# EAGLE schematic EspHeatController_v1.0 (EAGLE 9.7.0)

## Sheet 1 of 2
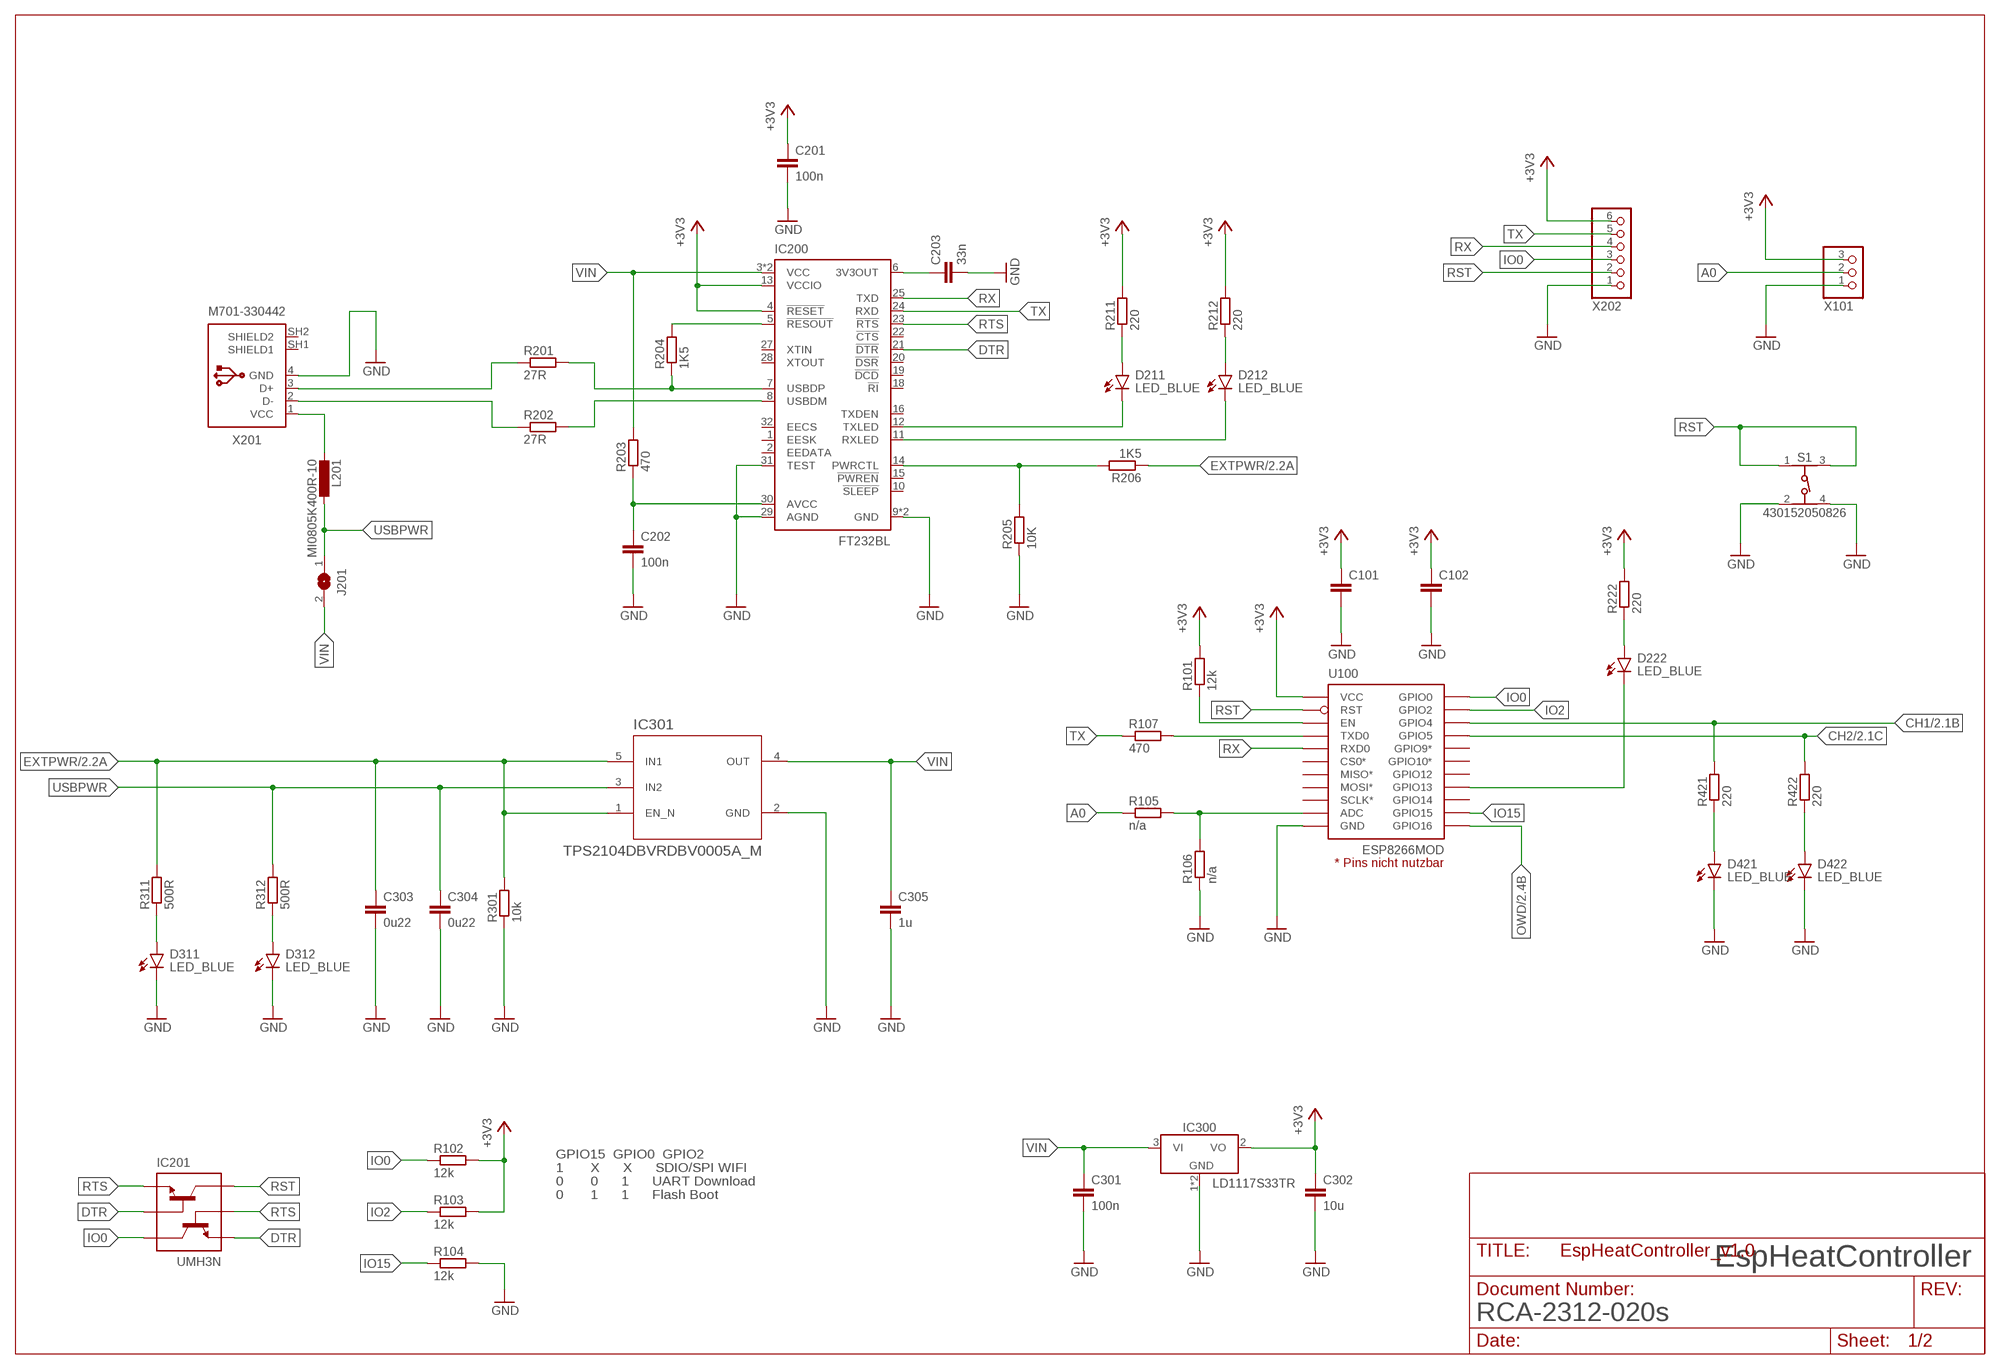
[diagram p0: schematic, sheet 1]

### Parts
C101  C-EUC0805  [C0805]
C102  C-EUC0805  [C0805]
C201  100n  C-EUC0805  [C0805]
C202  100n  C-EUC0805  [C0805]
C203  33n  C-EUC0805  [C0805]
C301  100n  C-EUC0805  [C0805]
C302  10u  C-EUC0805  [C0805]
C303  0u22  C-EUC0805  [C0805]
C304  0u22  C-EUC0805  [C0805]
C305  1u  C-EUC0805  [C0805]
D211  LED_BLUE  CHIP-FLAT-B_0805  [LEDC2012X110N_FLAT-B]
D212  LED_BLUE  CHIP-FLAT-B_0805  [LEDC2012X110N_FLAT-B]
D222  LED_BLUE  CHIP-FLAT-B_0805  [LEDC2012X110N_FLAT-B]
D311  LED_BLUE  CHIP-FLAT-B_0805  [LEDC2012X110N_FLAT-B]
D312  LED_BLUE  CHIP-FLAT-B_0805  [LEDC2012X110N_FLAT-B]
D421  LED_BLUE  CHIP-FLAT-B_0805  [LEDC2012X110N_FLAT-B]
D422  LED_BLUE  CHIP-FLAT-B_0805  [LEDC2012X110N_FLAT-B]
IC200  FT232BL  [LQFP32-7X7]
IC201  UMH3N  UMH3NTNSOT-363_ROM  [SOT-363_ROM]
IC300  LD1117S33TR  LD1117_SOT223  [SOT230P700X170-4]
IC301  TPS2104DBVRDBV0005A_M  [DBV0005A_M]
J201  SJ  [SJ]
L201  MI0805K400R-10  L-EUL2012C  [L2012C]
R101  12k  R-EU_R0603  [R0603]
R102  12k  R-EU_R0603  [R0603]
R103  12k  R-EU_R0603  [R0603]
R104  12k  R-EU_R0603  [R0603]
R105  n/a  R-EU_R0603  [R0603]
R106  n/a  R-EU_R0603  [R0603]
R107  470  R-EU_R0603  [R0603]
R201  27R  R-EU_R0603  [R0603]
R202  27R  R-EU_R0603  [R0603]
R203  470  R-EU_R0603  [R0603]
R204  1K5  R-EU_R0603  [R0603]
R205  10K  R-EU_R0603  [R0603]
R206  1K5  R-EU_R0603  [R0603]
R211  220  R-EU_R0603  [R0603]
R212  220  R-EU_R0603  [R0603]
R222  220  R-EU_R0603  [R0603]
R301  10k  R-EU_R0603  [R0603]
R311  500R  R-EU_R0603  [R0603]
R312  500R  R-EU_R0603  [R0603]
R421  220  R-EU_R0603  [R0603]
R422  220  R-EU_R0603  [R0603]
S1  430152050826  [430152050826]
U100  ESP8266MOD  [ESP12F-SMD]
X101  PINHD-1X3  [1X03]
X201  M701-330442  [M701-330442]
X202  PINHD-1X6  [1X06]

### Nets
+3V3: C101.1 C102.1 C201.1 C302.1 IC200.4(!RESET) IC200.13(VCCIO) IC300.2(VO) R101.2 R102.2 R103.2 R211.2 R212.2 R222.2 U100.VCC X101.3 X202.6 ; also sheet 2
A0: R105.1 X101.2
CH1: R421.2 U100.GPIO4 ; also sheet 2
CH2: R422.2 U100.GPIO5 ; also sheet 2
D_N [usb]: IC200.8(USBDM) R202.2
D_P [usb]: IC200.7(USBDP) R201.2 R204.1
DTR: IC200.21(!DTR) IC201.2(B1) IC201.4(E2)
EXTPWR: C303.1 IC301.1(EN_N) IC301.5(IN1) R206.1 R301.2 R311.2 ; also sheet 2
GND: C101.2 C102.2 C201.2 C202.2 C203.2 C301.2 C302.2 C303.2 C304.2 C305.2 D311.C D312.C D421.C D422.C IC200.9(GND) IC200.17(GND) IC200.29(AGND) IC200.31(TEST) IC300.1(GND) IC300.4(GND) IC301.2(GND) R104.2 R106.1 R205.1 R301.1 S1.2 S1.4 U100.GND X101.1 X201.4(GND) X202.1 ; also sheet 2
IO0: IC201.3(C2) R102.1 U100.GPIO0 X202.3
IO2: R103.1 U100.GPIO2
IO15: R104.1 U100.GPIO15
N$1: R105.2 R106.2 U100.ADC
N$2: R107.2 U100.TXD0
N$3: R101.1 U100.EN
N$4: D211.C IC200.12(TXLED)
N$5: C202.1 IC200.30(AVCC) R203.1
N$6: D212.C IC200.11(RXLED)
N$7: D211.A R211.1
N$8: D212.A R212.1
N$9: C203.1 IC200.6(3V3OUT)
N$10: D312.A R312.1
N$11: D422.A R422.1
N$13: L201.2 X201.1(VCC)
N$15: D311.A R311.1
N$16: D421.A R421.1
N$17: IC200.5(!RESOUT) R204.2
N$18: IC200.14(PWRCTL) R205.2 R206.2
N$19: D222.C U100.GPIO13
N$20: D222.A R222.1
OWD: U100.GPIO16 ; also sheet 2
RST: IC201.6(C1) S1.1 S1.3 U100.RST X202.2
RTS: IC200.23(!RTS) IC201.1(E1) IC201.5(B2)
RX: IC200.25(TXD) U100.RXD0 X202.4
TX: IC200.24(RXD) R107.1 X202.5
USBD_N [usb]: R202.1 X201.2(D-)
USBD_P [usb]: R201.1 X201.3(D+)
USBPWR: C304.1 IC301.3(IN2) J201.1 L201.1 R312.2
VIN: C301.1 C305.1 IC200.3(VCC) IC200.26(VCC) IC300.3(VI) IC301.4(OUT) J201.2 R203.2
Unconnected: IC200.1(EESK) IC200.2(EEDATA) IC200.10(!SLEEP) IC200.15(!PWREN) IC200.16(TXDEN) IC200.18(!RI) IC200.19(!DCD) IC200.20(!DSR) IC200.22(!CTS) IC200.27(XTIN) IC200.28(XTOUT) IC200.32(EECS) U100.CS0(CS0*) U100.GPIO9(GPIO9*) U100.GPIO10(GPIO10*) U100.GPIO12 U100.GPIO14 U100.MISO(MISO*) U100.MOSI(MOSI*) U100.SCLK(SCLK*) X201.SH1(SHIELD1) X201.SH2(SHIELD2)

### Notes on the sheet
- GPIO15  GPIO0  GPIO2
  1       X      X      SDIO/SPI WIFI
  0       0      1      UART Download
  0       1      1      Flash Boot
- EspHeatController
- RCA-2312-020s

## Sheet 2 of 2
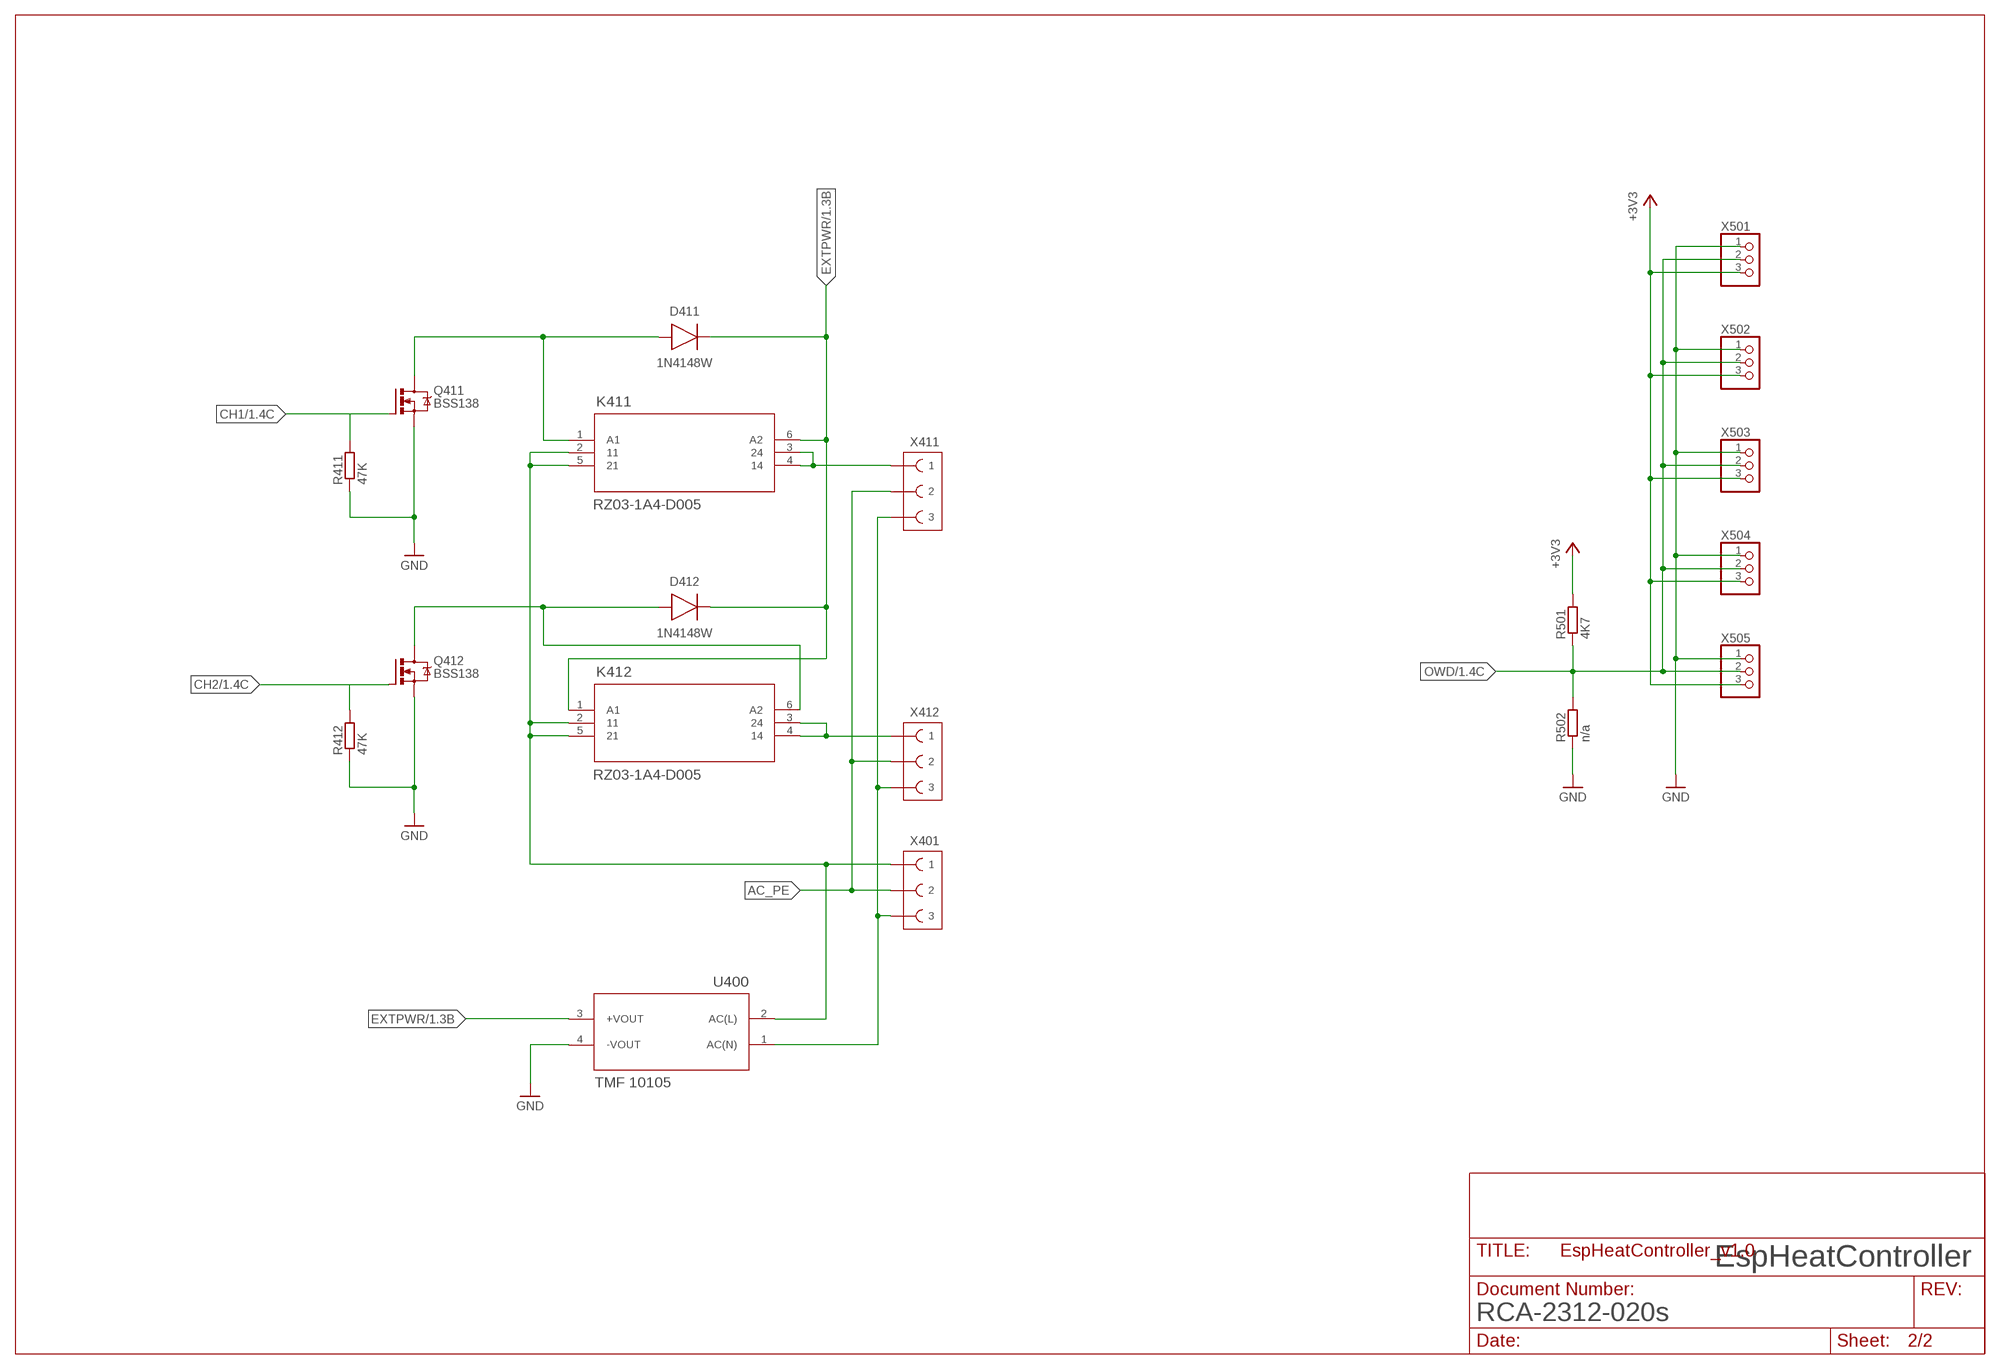
[diagram p1: schematic, sheet 2]

### Parts
D411  1N4148W  DIODE_1N4148W-7-F_SOD123G  [SOD3715X135]
D412  1N4148W  DIODE_1N4148W-7-F_SOD123G  [SOD3715X135]
K411  RZ03-1A4-D005  1-1415899-6  [RELAY-SPST2_5MM]
K412  RZ03-1A4-D005  1-1415899-6  [RELAY-SPST2_5MM]
Q411  BSS138  NMOSFETSOT23-GSD  [SOT23]
Q412  BSS138  NMOSFETSOT23-GSD  [SOT23]
R411  47K  R-EU_R0805W  [R0805W]
R412  47K  R-EU_R0805W  [R0805W]
R501  4K7  R-EU_R0805W  [R0805W]
R502  n/a  R-EU_R0805W  [R0805W]
U400  TMF 10105  TMF_101  [TMF10]
X401  SPT2,5/3-V-5,0  [SPT2,5/3-V-5,0]
X411  SPT2,5/3-V-5,0  [SPT2,5/3-V-5,0]
X412  SPT2,5/3-V-5,0  [SPT2,5/3-V-5,0]
X501  PINHD-1X3  [1X03]
X502  PINHD-1X3  [1X03]
X503  PINHD-1X3  [1X03]
X504  PINHD-1X3  [1X03]
X505  PINHD-1X3  [1X03]

### Nets
+3V3: R501.2 X501.3 X502.3 X503.3 X504.3 X505.3 ; also sheet 1
AC_L: K411.2 K411.5 K412.2 K412.5 U400.2(AC(L)) X401.1A X401.1B
AC_N: U400.1(AC(N)) X401.3A X401.3B X411.3A X411.3B X412.3A X412.3B
AC_PE: X401.2A X401.2B X411.2A X411.2B X412.2A X412.2B
CH1: Q411.1(G) R411.2 ; also sheet 1
CH2: Q412.1(G) R412.2 ; also sheet 1
EXTPWR: D411.1(C) D412.1(C) K411.6(A2) K412.1(A1) U400.3(+VOUT) ; also sheet 1
GND: Q411.2(S) Q412.2(S) R411.1 R412.1 R502.1 U400.4(-VOUT) X501.1 X502.1 X503.1 X504.1 X505.1 ; also sheet 1
N$12: D412.2(A) K412.6(A2) Q412.3(D)
N$14: D411.2(A) K411.1(A1) Q411.3(D)
N$23: K411.3 K411.4 X411.1A X411.1B
N$24: K412.3 K412.4 X412.1A X412.1B
OWD: R501.1 R502.2 X501.2 X502.2 X503.2 X504.2 X505.2 ; also sheet 1

### Notes on the sheet
- EspHeatController
- RCA-2312-020s

## Library data of the parts
C101 C102 C201-C203 C301-C305 = rcl:C-EU: CAPACITOR, European symbol; SPICEPREFIX: C
D211 D212 D222 D311 D312 D421 D422 = LED:CHIP-FLAT-B; CATEGORY: LED; COLOR: BLUE; DESCRIPTION: CHIP LED FLAT; SUB-CATEGORY: CHIP; TYPE: FLAT_TOP
D411 D412 = Diode:DIODE_: Diode Rectifier - Popular parts; CATEGORY: Diode; DESCRIPTION: DIODE GEN PURP 100V 300MA SOD123; MANUFACTURER: Diodes Incorporated; SUB-CATEGORY: Rectifier
IC200 = FutureTechnologyDevicesInternational:FT232B: USB to serial UART interface Source: DS_FT232BL_BQ.pdf; MF: FARNELL; MPN: FT232BL/TR; OC_FARNELL: unknown; OC_NEWARK: 38K1551
IC201 = RohmSemiconductor:UMH3NTN; COPYRIGHT: Copyright (C) 2023 Ultra Librarian. All rights reserved.; MANUFACTURER_PART_NUMBER: UMH3NTN; MFR_NAME: ROHM Semiconductor
IC300 = IC_Power-Management:LD1117: Adjustable and fixed positive voltage regulator Reference Datasheet <https://www.st.com/content/ccc/resource/technical/document/datasheet/99/3b/7d/91/91/51/4b/be/CD00000544.pdf/files/CD00000544.pdf/jcr:content/translations/en.CD00000544.pdf>; CATEGORY: IC_Linear; DESCRIPTION: Adjustable voltage regulator; MANUFACTURER: STMicroelectronics; MPN: Generic; SERIES: LM1117; SUB-CATEGORY: Voltage Regulator; TYPE: Linear
IC301 = TexasInstruments:TPS2104DBVR; COPYRIGHT: Copyright (C) 2023 Ultra Librarian. All rights reserved.; MANUFACTURER_PART_NUMBER: TPS2104DBVR; MFR_NAME: Texas Instruments; REFDES: RefDes; TYPE: TYPE
J201 = jumper:SJ: SMD solder JUMPER
K411 K412 = Relays:1-1415899-6; BUILT_BY: EMA_UL_Team; CATEGORY: Power Relays; COPYRIGHT: Copyright (C) 2016 Accelerated Designs. All rights reserved; DESCRIPTION: RZ03-1A4-D012; MANUFACTURER_PART_NUMBER: 1-1415899-6; PART_STATUS: active; SERIES: SCHRACK Power PCB Relay RZ; VENDOR: TE Connectivity
L201 = rcl:L-EU: INDUCTOR, European symbol; SPICEPREFIX: L
Q411 Q412 = Transistor:NMOSFET: N-Channel MOSFET - Generic; CATEGORY: Transistor; SUB-CATEGORY: MOSFET; TYPE: N-Channel; VALUE: NMOSFET
R101-R107 R201-R206 R211 R212 R222 R301 R311 R312 R411 R412 R421 R422 R501 R502 = rcl:R-EU_: RESISTOR, European symbol; SPICEPREFIX: R
S1 = Wurth_Switch_WS-TASV:430152050826: WS-TASV SMT Tact Switch 6x6 mm Material Properties Cover Material : Stainless Steel Properties Actuator Material:LCP Actuator Flammability :UL94 V-0 Rating Actuator Color:Black; Salmon; White Frame Material:LCP Flammability Rating:UL94 V-0 Frame Color:Black Contact Material:Stainless Steel Contact Plating:Silver Terminal Material:Copper Alloy Terminal Plating:Silver VR:12 V (DC) Contact Resistance Initial:100 mΩ Contact Resistance After Life Test:2Ω RISO:100 MΩ Withstanding Voltage:250 V (AC) Washable:No Qty.:4000;5000 Mechanical Properties Electrical Life:400; 550; 1000 Stroke :0.25 mm General Information Operating Temperature:-40 up to +85 °C Washable:No Packaging Properties Packaging:Tape and Reel <https://www.we-online.com/catalog/media/o37470v209%20Family_WS-TASV_6x6mm_SMD_Tact_Switch_4301820xx8xx.jpg> Details see: https://www.we-online.com/catalog/en/TASV_6X6_SMD/ Updated by yingchun,Shan;2020-02-18 2020(C) Würth Elektronik; DATASHEET-URL: https://www.we-online.com/redexpert/spec/430152050826?ae; HEIGHT: 5mm; OPERATION-FORCE: 260g; PART-NUMBER: 430152050826; QTY: 1000
U100 = EspressifSystems:ESP8266MOD
U400 = TracoPower:TMF_101
X101 X501-X505 = pinhead:PINHD-1X3: PIN HEADER
X201 = Connector_USB:M701-330442: USB(2.0) Type-B, RCPT, 4POS, THT-VERT Datasheet <https://cdn.harwin.com/pdfs/M701-330442.pdf>; CATEGORY: Connector; CONTACTS: 4; CURRENT_RATING: 1.5A; DESCRIPTION: CONN RCPT USB2.0 TYPEB 4POS VERT; GENDER: Receptacle; MANUFACTURER: Harwin; MOUNT_TYPE: Vertical; MPN: M701-330442; OPERATING_TEMP: -55°C to +85°C; PART_STATUS: Active; ROHS_COMPLIANT: RoHS Compliant; SERIES: -; SUB-CATEGORY: USB; TYPE: USB-B; VOLTAGE_RATING: 30VAC/DC
X202 = pinhead:PINHD-1X6: PIN HEADER
X401 X411 X412 = PhoenixContact:SPT2,5/3-V-5,0: SPT 2,5/ 3-V-5,0 Leiterplattenklemme 1991105 PCB terminal block, nominal current: 24 A, rated voltage (III/2): 400 V, nominal cross section: 2.5 mm?, Number of potentials: 3, Number of rows: 1, Number of positions per row: 3, product range: SPT 2,5/..-V, pitch: 5 mm, connection method: Push-in spring connection, mounting: Wave soldering, conductor/PCB connection direction: 90 ?, color: green, Pin layout: Linear double pinning, Solder pin [P]: 2.5 mm, type of packaging: packed in cardboard Source: Datasheet <http://www.phoenixcontact.com/gb/produkte/1991105>; ARROW_PART_NUMBER: 1991105; ARROW_PRICE-STOCK: https://www.arrow.com/en/products/1991105/phoenix-contact?region=nac; DESCRIPTION: PCB terminal block, nominal current: 24 A, rated voltage (III/2): 400 V, nominal cross section: 2.5 mm?, Number of potentials: 3, Number of rows: 1, Number of positions per row: 3, product range: SPT 2,5/..-V, pitch: 5 mm, connection method: Push-in spring connection, mounting: Wave soldering, conductor/PCB connection direction: 90 ?, color: green, Pin layout: Linear double pinning, Solder pin [P]: 2.5 mm, type of packaging: packed in cardboard; HEIGHT: 14.4mm; MANUFACTURER_NAME: Phoenix Contact; MANUFACTURER_PART_NUMBER: 1991105; MOUSER_PART_NUMBER: 651-1991105; MOUSER_PRICE-STOCK: https://www.mouser.co.uk/ProductDetail/Phoenix-Contact/1991105?qs=HG6crFoccqodg51MDMYEiw%3D%3D

## Net classes
0 default: width 0.254 mm, clearance 0.254 mm
1 usb: width 0.254 mm, clearance 0.254 mm